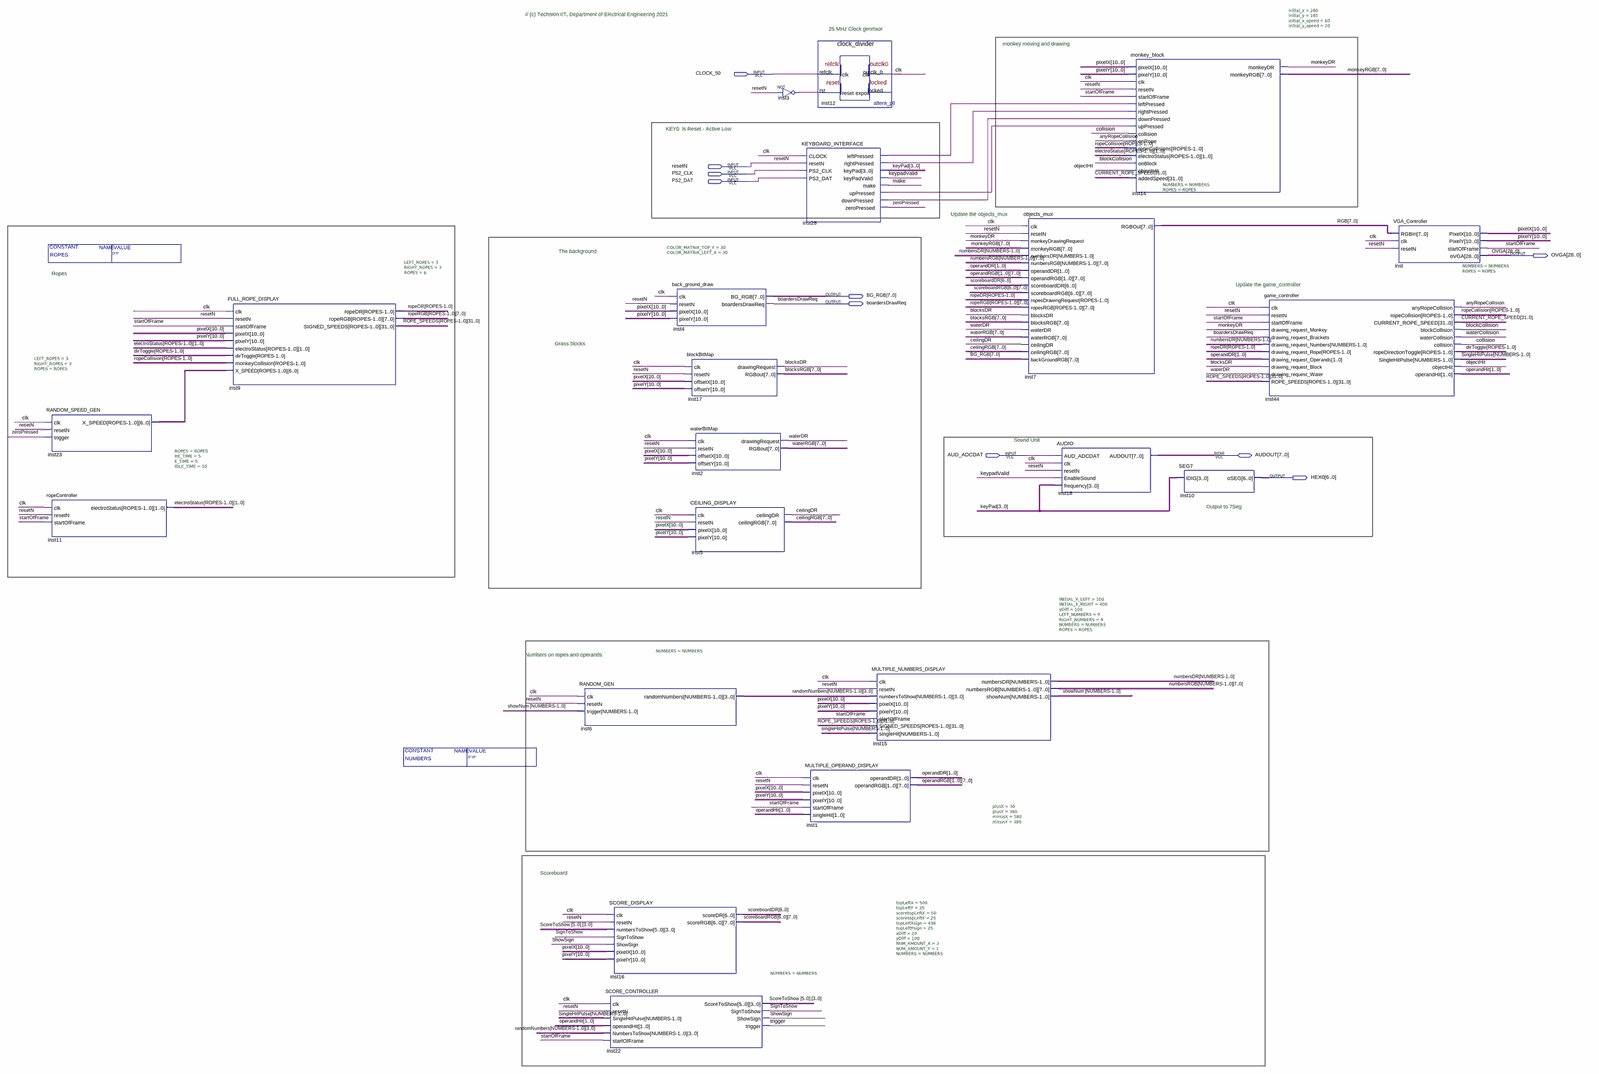
[diagram p0: schematic sheet, whole]
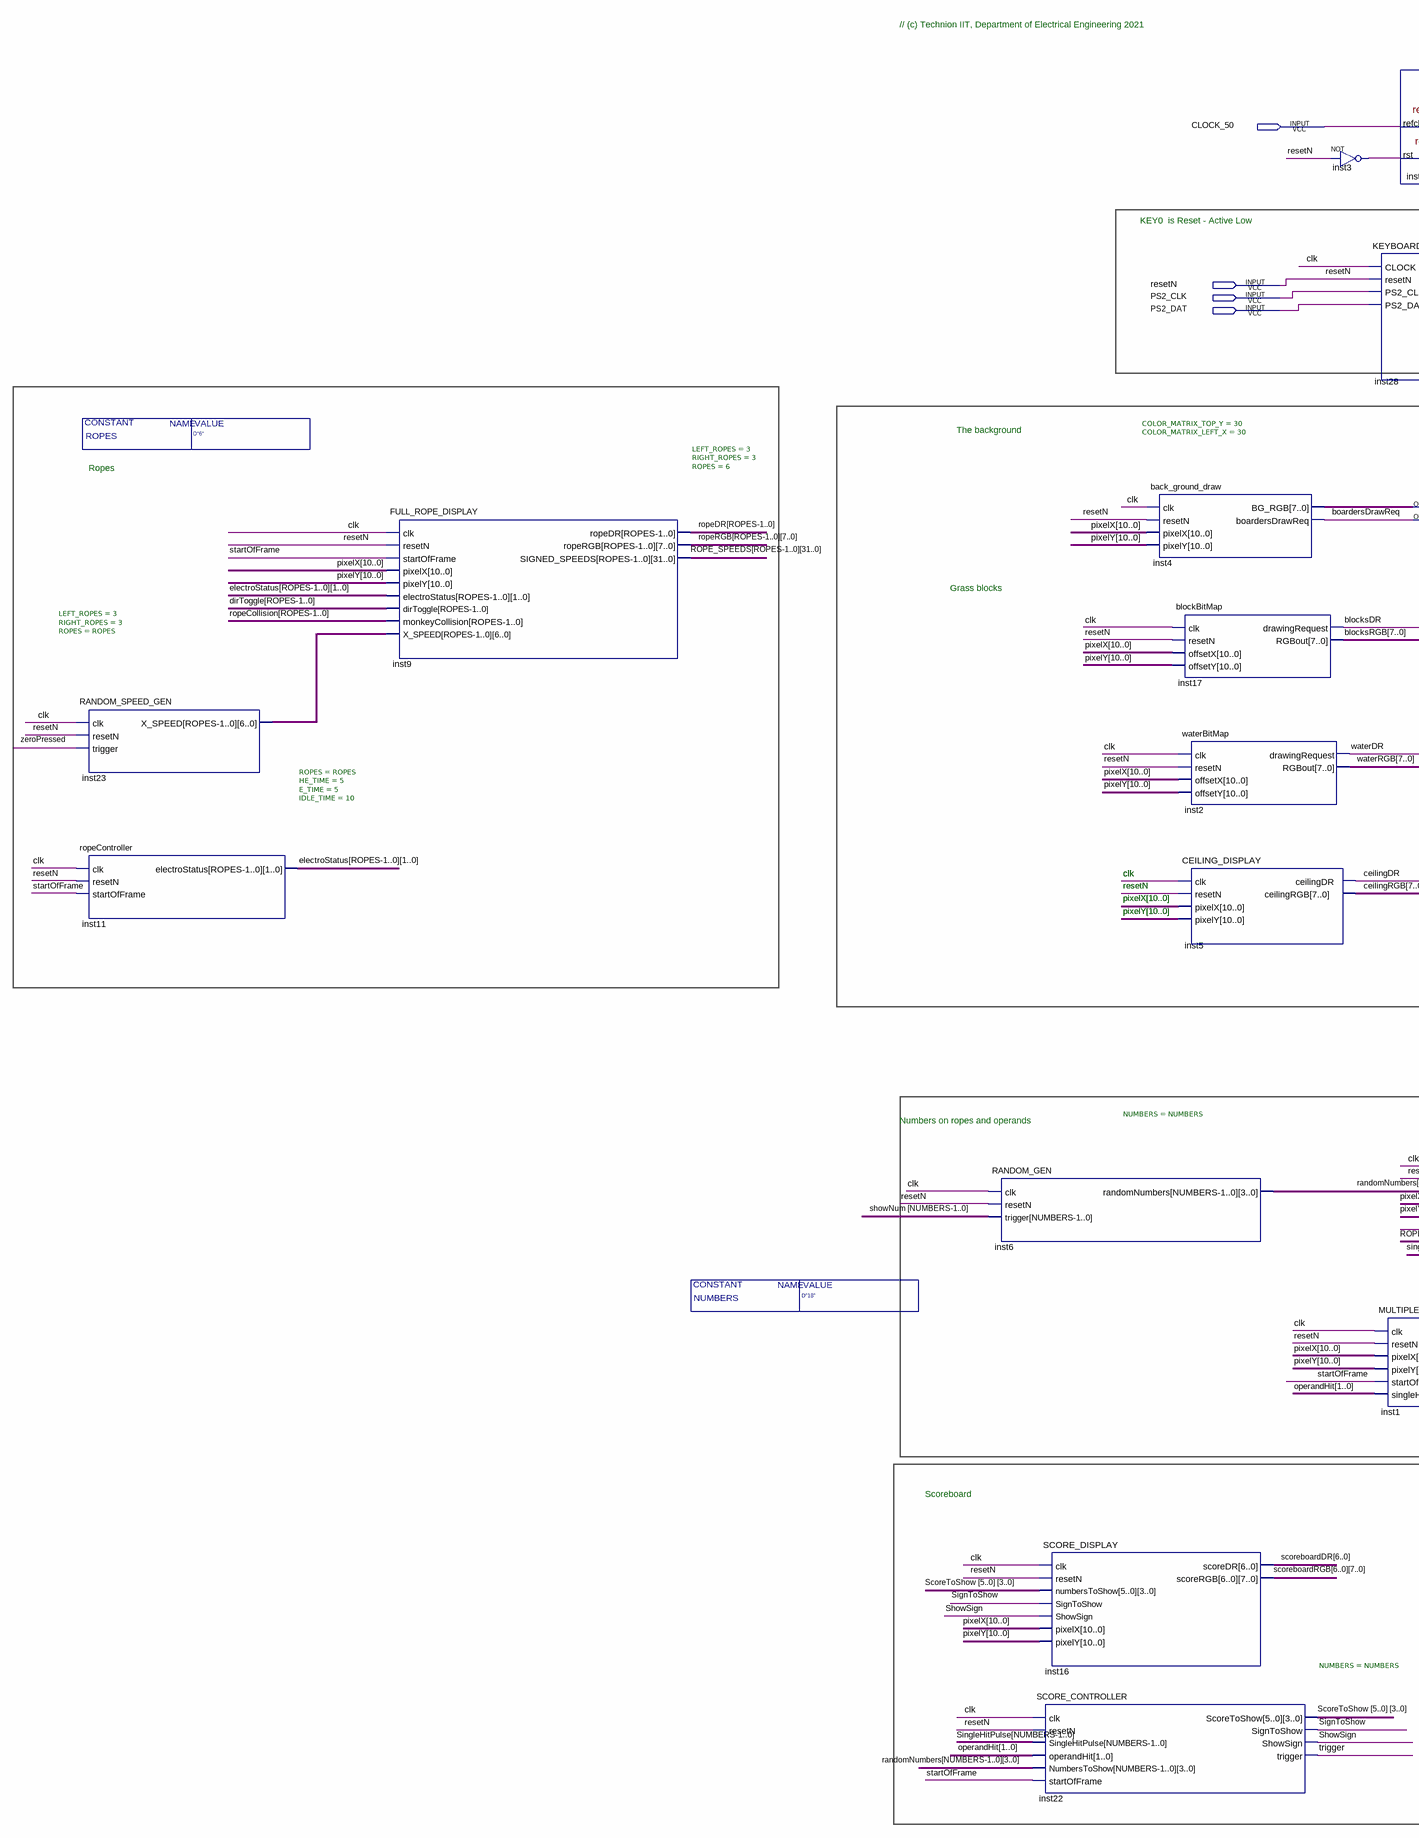
[diagram p1: schematic sheet, left part]
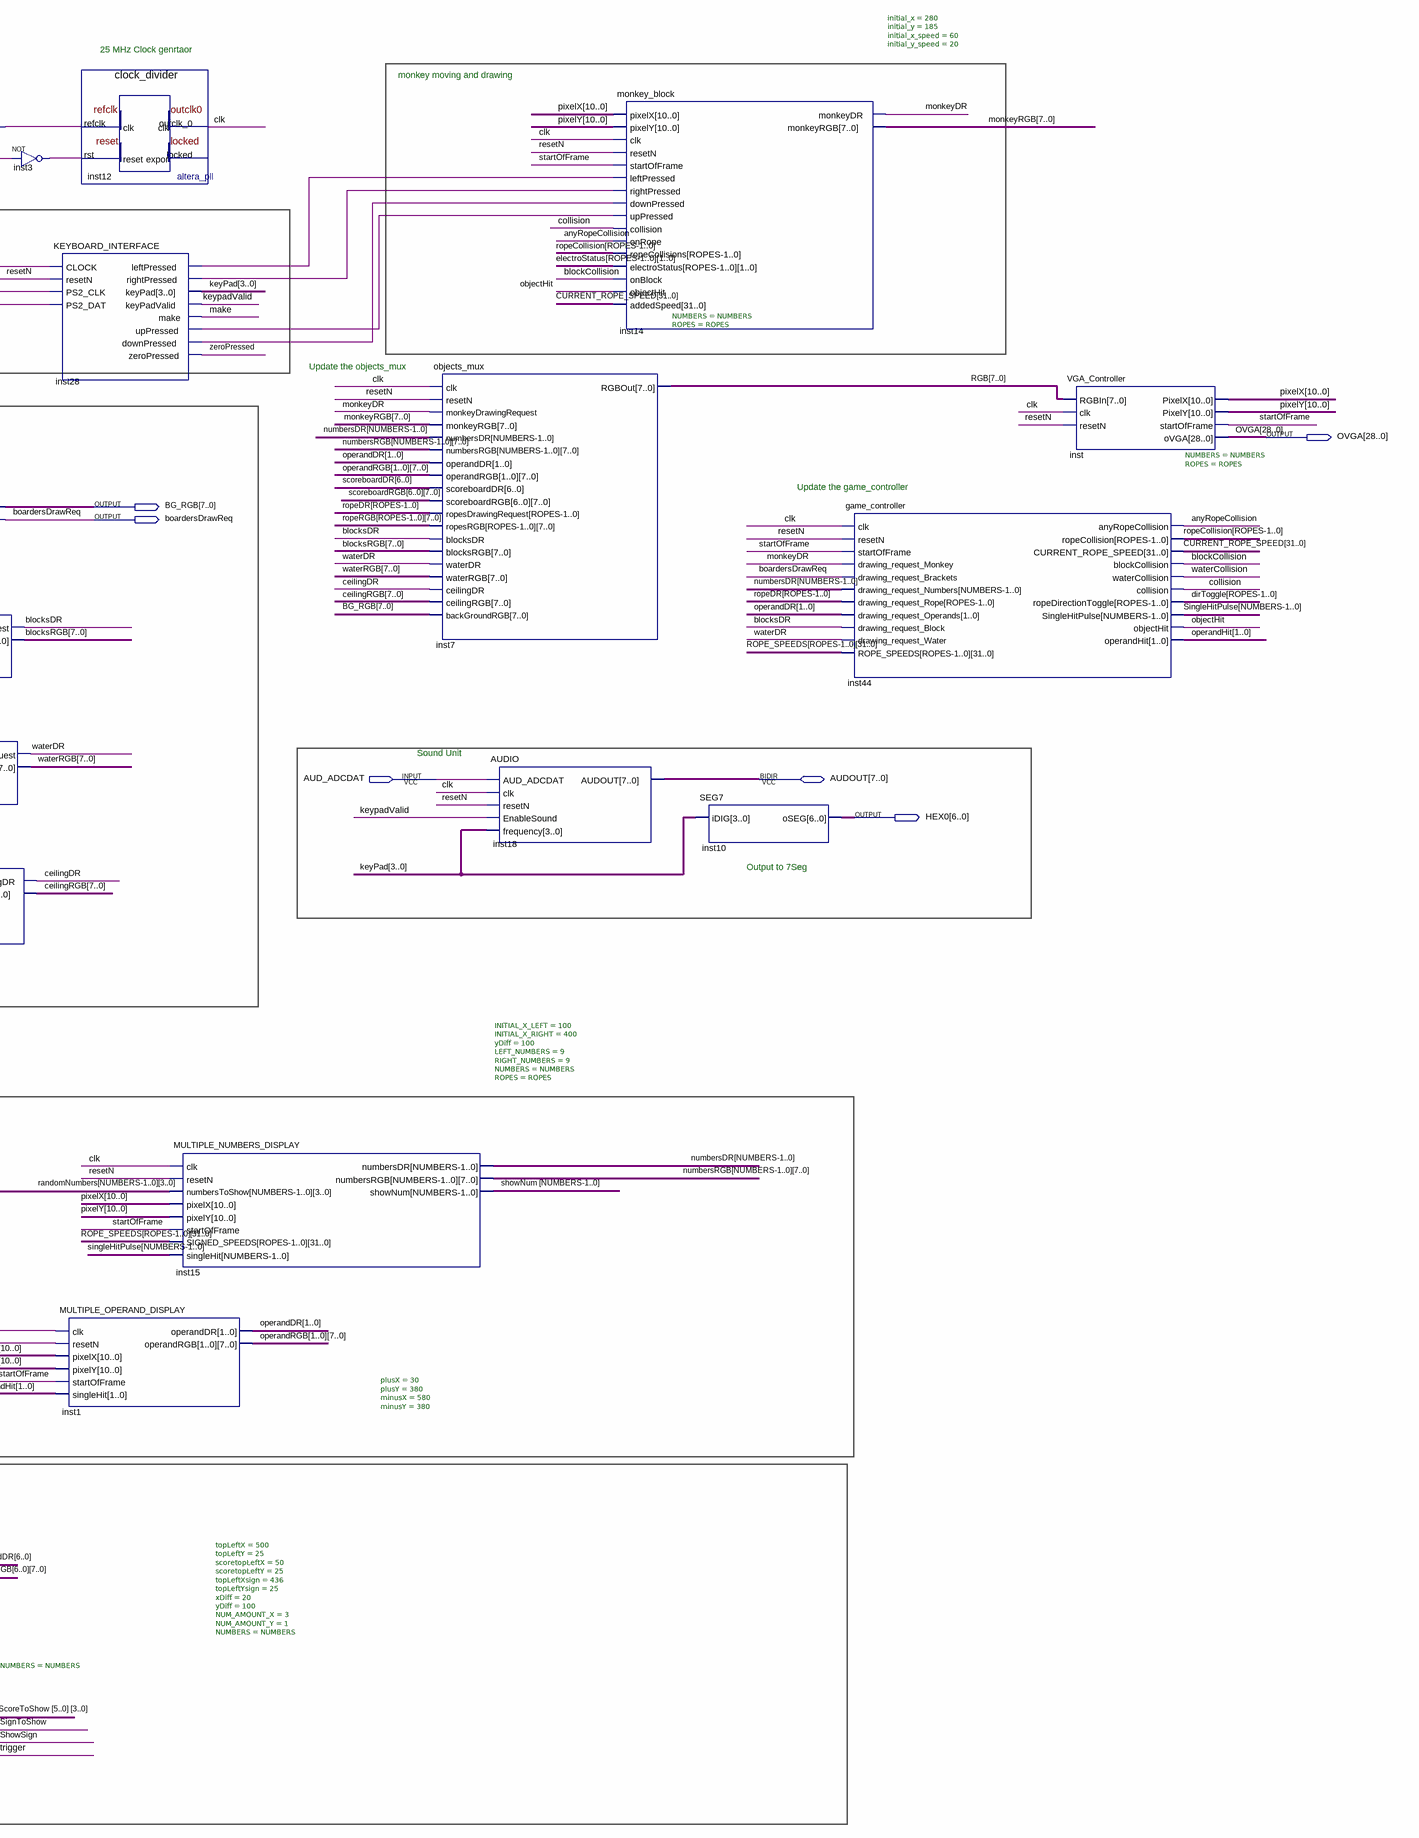
[diagram p2: schematic sheet, right part]
// Quartus schematic TOP_VGA_DEMO_KBD.bdf as structural Verilog: 21 symbols, 10 pins
module TOP_VGA_DEMO_KBD #(parameter ROPES = "D\"6\"", parameter NUMBERS = "D\"18\"") (
  input  CLOCK_50,
  input  resetN,
  input  PS2_CLK,
  input  PS2_DAT,
  input  AUD_ADCDAT,
  inout  [7:0] AUDOUT,
  output [28:0] OVGA,
  output [7:0] BG_RGB,
  output boardersDrawReq,
  output [6:0] HEX0
);

  wire anyRopeCollision, blockCollision, blocksDR, ceilingDR, clk, collision, \dirToggle[ROPES-1..0] ,
       inst3_out, inst28_downpressed, inst28_leftpressed, inst28_rightpressed, inst28_uppressed, keypadValid,
       make, monkeyDR, \numbersDR[NUMBERS-1..0] , objectHit, \ropeCollision[ROPES-1..0] ,
       \ropeDR[ROPES-1..0] , \showNum_[NUMBERS-1..0] , ShowSign, SignToShow, \SingleHitPulse[NUMBERS-1..0] ,
       startOfFrame, trigger, waterCollision, waterDR, zeroPressed;
  wire [1:0] \electroStatus[ROPES-1..0] , operandDR, operandHit;
  wire [3:0] keyPad, \randomNumbers[NUMBERS-1..0] , \ScoreToShow_[5..0] ;
  wire [6:0] scoreboardDR;
  wire [7:0] blocksRGB, ceilingRGB, monkeyRGB, \numbersRGB[NUMBERS-1..0] , operandRGB_0, operandRGB_1, RGB,
       \ropeRGB[ROPES-1..0] , scoreboardRGB_0, scoreboardRGB_1, scoreboardRGB_2, scoreboardRGB_3,
       scoreboardRGB_4, scoreboardRGB_5, scoreboardRGB_6, waterRGB;
  wire [10:0] pixelX, pixelY;
  wire [31:0] CURRENT_ROPE_SPEED, \ROPE_SPEEDS[ROPES-1..0] ;
  wire [41:0] inst23_x_speed;

  RANDOM_SPEED_GEN #(.LEFT_ROPES(3), .RIGHT_ROPES(3), .ROPES(ROPES)) inst23 (
    .clk(clk), .resetN(resetN), .trigger(zeroPressed), .X_SPEED(inst23_x_speed));
  ropeController #(.ROPES(ROPES), .HE_TIME(5), .E_TIME(5), .IDLE_TIME(10)) inst11 (
    .clk(clk), .resetN(resetN), .startOfFrame(startOfFrame), .electroStatus(\electroStatus[ROPES-1..0] ));
  FULL_ROPE_DISPLAY #(.LEFT_ROPES(3), .RIGHT_ROPES(3), .ROPES(6)) inst9 (
    .clk(clk), .resetN(resetN), .startOfFrame(startOfFrame), .pixelX(pixelX), .pixelY(pixelY),
    .electroStatus(\electroStatus[ROPES-1..0] ), .dirToggle({6{\dirToggle[ROPES-1..0] }}),
    .monkeyCollision({6{\ropeCollision[ROPES-1..0] }}), .X_SPEED(inst23_x_speed),
    .ropeDR(\ropeDR[ROPES-1..0] ), .ropeRGB(\ropeRGB[ROPES-1..0] ), .SIGNED_SPEEDS(\ROPE_SPEEDS[ROPES-1..0] ));
  RANDOM_GEN #(.NUMBERS(NUMBERS)) inst6 (
    .clk(clk), .resetN(resetN), .trigger(\showNum_[NUMBERS-1..0] ),
    .randomNumbers(\randomNumbers[NUMBERS-1..0] ));
  SCORE_DISPLAY #(.topLeftX(500), .topLeftY(25), .scoretopLeftX(50), .scoretopLeftY(25), .topLeftXsign(436), .topLeftYsign(25), .xDiff(20), .yDiff(100), .NUM_AMOUNT_X(3), .NUM_AMOUNT_Y(1), .NUMBERS(NUMBERS)) inst16 (
    .clk(clk), .resetN(resetN), .numbersToShow(\ScoreToShow_[5..0] ), .SignToShow(SignToShow),
    .ShowSign(ShowSign), .pixelX(pixelX), .pixelY(pixelY), .scoreDR(scoreboardDR),
    .scoreRGB({scoreboardRGB_6, scoreboardRGB_5, scoreboardRGB_4, scoreboardRGB_3, scoreboardRGB_2, scoreboardRGB_1, scoreboardRGB_0}));
  SCORE_CONTROLLER #(.NUMBERS(NUMBERS)) inst22 (
    .clk(clk), .resetN(resetN), .SingleHitPulse(\SingleHitPulse[NUMBERS-1..0] ), .operandHit(operandHit),
    .NumbersToShow(\randomNumbers[NUMBERS-1..0] ), .startOfFrame(startOfFrame),
    .ScoreToShow(\ScoreToShow_[5..0] ), .SignToShow(SignToShow), .ShowSign(ShowSign), .trigger(trigger));
  back_ground_draw #(.COLOR_MATRIX_TOP_Y(30), .COLOR_MATRIX_LEFT_X(30)) inst4 (
    .clk(clk), .resetN(resetN), .pixelX(pixelX), .pixelY(pixelY), .BG_RGB(BG_RGB),
    .boardersDrawReq(boardersDrawReq));
  blockBitMap inst17 (
    .clk(clk), .resetN(resetN), .offsetX(pixelX), .offsetY(pixelY), .drawingRequest(blocksDR),
    .RGBout(blocksRGB));
  waterBitMap inst2 (
    .clk(clk), .resetN(resetN), .offsetX(pixelX), .offsetY(pixelY), .drawingRequest(waterDR),
    .RGBout(waterRGB));
  CEILING_DISPLAY inst5 (
    .clk(clk), .resetN(resetN), .pixelX(pixelX), .pixelY(pixelY), .ceilingDR(ceilingDR),
    .ceilingRGB(ceilingRGB));
  not inst3 (inst3_out, resetN);
  KEYBOARD_INTERFACE inst28 (
    .CLOCK(clk), .resetN(resetN), .PS2_CLK(PS2_CLK), .PS2_DAT(PS2_DAT), .leftPressed(inst28_leftpressed),
    .rightPressed(inst28_rightpressed), .keyPad(keyPad), .keyPadValid(keypadValid), .make(make),
    .upPressed(inst28_uppressed), .downPressed(inst28_downpressed), .zeroPressed(zeroPressed));
  MULTIPLE_OPERAND_DISPLAY #(.plusX(30), .plusY(380), .minusX(580), .minusY(380)) inst1 (
    .clk(clk), .resetN(resetN), .pixelX(pixelX), .pixelY(pixelY), .startOfFrame(startOfFrame),
    .singleHit(operandHit), .operandDR(operandDR), .operandRGB({operandRGB_1, operandRGB_0}));
  clock_divider inst12 (.refclk(CLOCK_50), .rst(inst3_out), .outclk_0(clk));  // open: locked
  MULTIPLE_NUMBERS_DISPLAY #(.INITIAL_X_LEFT(100), .INITIAL_X_RIGHT(400), .yDiff(100), .LEFT_NUMBERS(9), .RIGHT_NUMBERS(9), .NUMBERS(NUMBERS), .ROPES(ROPES)) inst15 (
    .clk(clk), .resetN(resetN), .numbersToShow(\randomNumbers[NUMBERS-1..0] ), .pixelX(pixelX),
    .pixelY(pixelY), .startOfFrame(startOfFrame), .SIGNED_SPEEDS(\ROPE_SPEEDS[ROPES-1..0] ),
    .singleHit(\SingleHitPulse[NUMBERS-1..0] ), .numbersDR(\numbersDR[NUMBERS-1..0] ),
    .numbersRGB(\numbersRGB[NUMBERS-1..0] ), .showNum(\showNum_[NUMBERS-1..0] ));
  objects_mux #(.NUMBERS(NUMBERS), .ROPES(ROPES)) inst7 (
    .clk(clk), .resetN(resetN), .monkeyDrawingRequest(monkeyDR), .monkeyRGB(monkeyRGB),
    .numbersDR(\numbersDR[NUMBERS-1..0] ), .numbersRGB(\numbersRGB[NUMBERS-1..0] ), .operandDR(operandDR),
    .operandRGB({operandRGB_1, operandRGB_0}), .scoreboardDR(scoreboardDR),
    .scoreboardRGB({scoreboardRGB_6, scoreboardRGB_5, scoreboardRGB_4, scoreboardRGB_3, scoreboardRGB_2, scoreboardRGB_1, scoreboardRGB_0}),
    .ropesDrawingRequest(\ropeDR[ROPES-1..0] ), .ropesRGB(\ropeRGB[ROPES-1..0] ), .blocksDR(blocksDR),
    .blocksRGB(blocksRGB), .waterDR(waterDR), .waterRGB(waterRGB), .ceilingDR(ceilingDR),
    .ceilingRGB(ceilingRGB), .backGroundRGB(BG_RGB), .RGBOut(RGB));
  AUDIO inst18 (
    .AUD_ADCDAT(AUD_ADCDAT), .clk(clk), .resetN(resetN), .EnableSound(keypadValid), .frequency(keyPad),
    .AUDOUT(AUDOUT));
  monkey_block #(.initial_x(280), .initial_y(185), .initial_x_speed(60), .initial_y_speed(20)) inst14 (
    .pixelX(pixelX), .pixelY(pixelY), .clk(clk), .resetN(resetN), .startOfFrame(startOfFrame),
    .leftPressed(inst28_leftpressed), .rightPressed(inst28_rightpressed), .downPressed(inst28_downpressed),
    .upPressed(inst28_uppressed), .collision(collision), .onRope(anyRopeCollision),
    .ropeCollisions(\ropeCollision[ROPES-1..0] ), .electroStatus(\electroStatus[ROPES-1..0] ),
    .onBlock(blockCollision), .objectHit(objectHit), .addedSpeed(CURRENT_ROPE_SPEED), .monkeyDR(monkeyDR),
    .monkeyRGB(monkeyRGB));
  SEG7 inst10 (.iDIG(keyPad), .oSEG(HEX0));
  game_controller #(.NUMBERS(NUMBERS), .ROPES(ROPES)) inst44 (
    .clk(clk), .resetN(resetN), .startOfFrame(startOfFrame), .drawing_request_Monkey(monkeyDR),
    .drawing_request_Brackets(boardersDrawReq), .drawing_request_Numbers(\numbersDR[NUMBERS-1..0] ),
    .drawing_request_Rope(\ropeDR[ROPES-1..0] ), .drawing_request_Operands(operandDR),
    .drawing_request_Block(blocksDR), .drawing_request_Water(waterDR),
    .ROPE_SPEEDS(\ROPE_SPEEDS[ROPES-1..0] ), .anyRopeCollision(anyRopeCollision),
    .ropeCollision(\ropeCollision[ROPES-1..0] ), .CURRENT_ROPE_SPEED(CURRENT_ROPE_SPEED),
    .blockCollision(blockCollision), .waterCollision(waterCollision), .collision(collision),
    .ropeDirectionToggle(\dirToggle[ROPES-1..0] ), .SingleHitPulse(\SingleHitPulse[NUMBERS-1..0] ),
    .objectHit(objectHit), .operandHit(operandHit));
  VGA_Controller inst (
    .RGBIn(RGB), .clk(clk), .resetN(resetN), .PixelX(pixelX), .PixelY(pixelY), .startOfFrame(startOfFrame),
    .oVGA(OVGA));

  // Notes on the sheet:
  //   // (c) Technion IIT, Department of Electrical Engineering 2021
  //   25 MHz Clock genrtaor
  //   monkey moving and drawing
  //   KEY0  is Reset - Active Low
  //   Update the objects_mux
  //   The background
  //   Ropes
  //   Update the game_controller
  //   Grass blocks
  //   Sound Unit
  //   Output to 7Seg
  //   clk
  //   resetN
  //   pixelX[10..0]
  //   pixelY[10..0]
  //   Numbers on ropes and operands 
  //   Scoreboard
endmodule
